# Altium schematic sheet GS_01_Pow.SchDoc: Title
size A1; Date: Date; CompanyName: Integrated Micro-Electronics Bulgaria; Organization: Design & Development Department; Address1: Drawing Type; Address2: Address 1; Address3: Address 2; Address4: Address 3; DocumentNumber: 730xxx; Revision: 01; SheetNumber: 1; SheetTotal: 1; PageSetup: Record=PageOptions|CenterHorizontal=True|CenterVertical=True|PrintScale=0.70|XCorrection=1.00|YCorrection=1.00|PrintKind=2|BorderSize=5000000|LeftOffset=0|BottomOffset=0|Orientation=2|PaperLength=1000|PaperWidth=1000|Scale=100|PaperSource=7|PrintQuality=-4|MediaType=1|DitherType=10|PaperKind=A4|PrintScaleMode=1; SheetSize: A3; Time: Time; ModifiedDate: Mod. Date
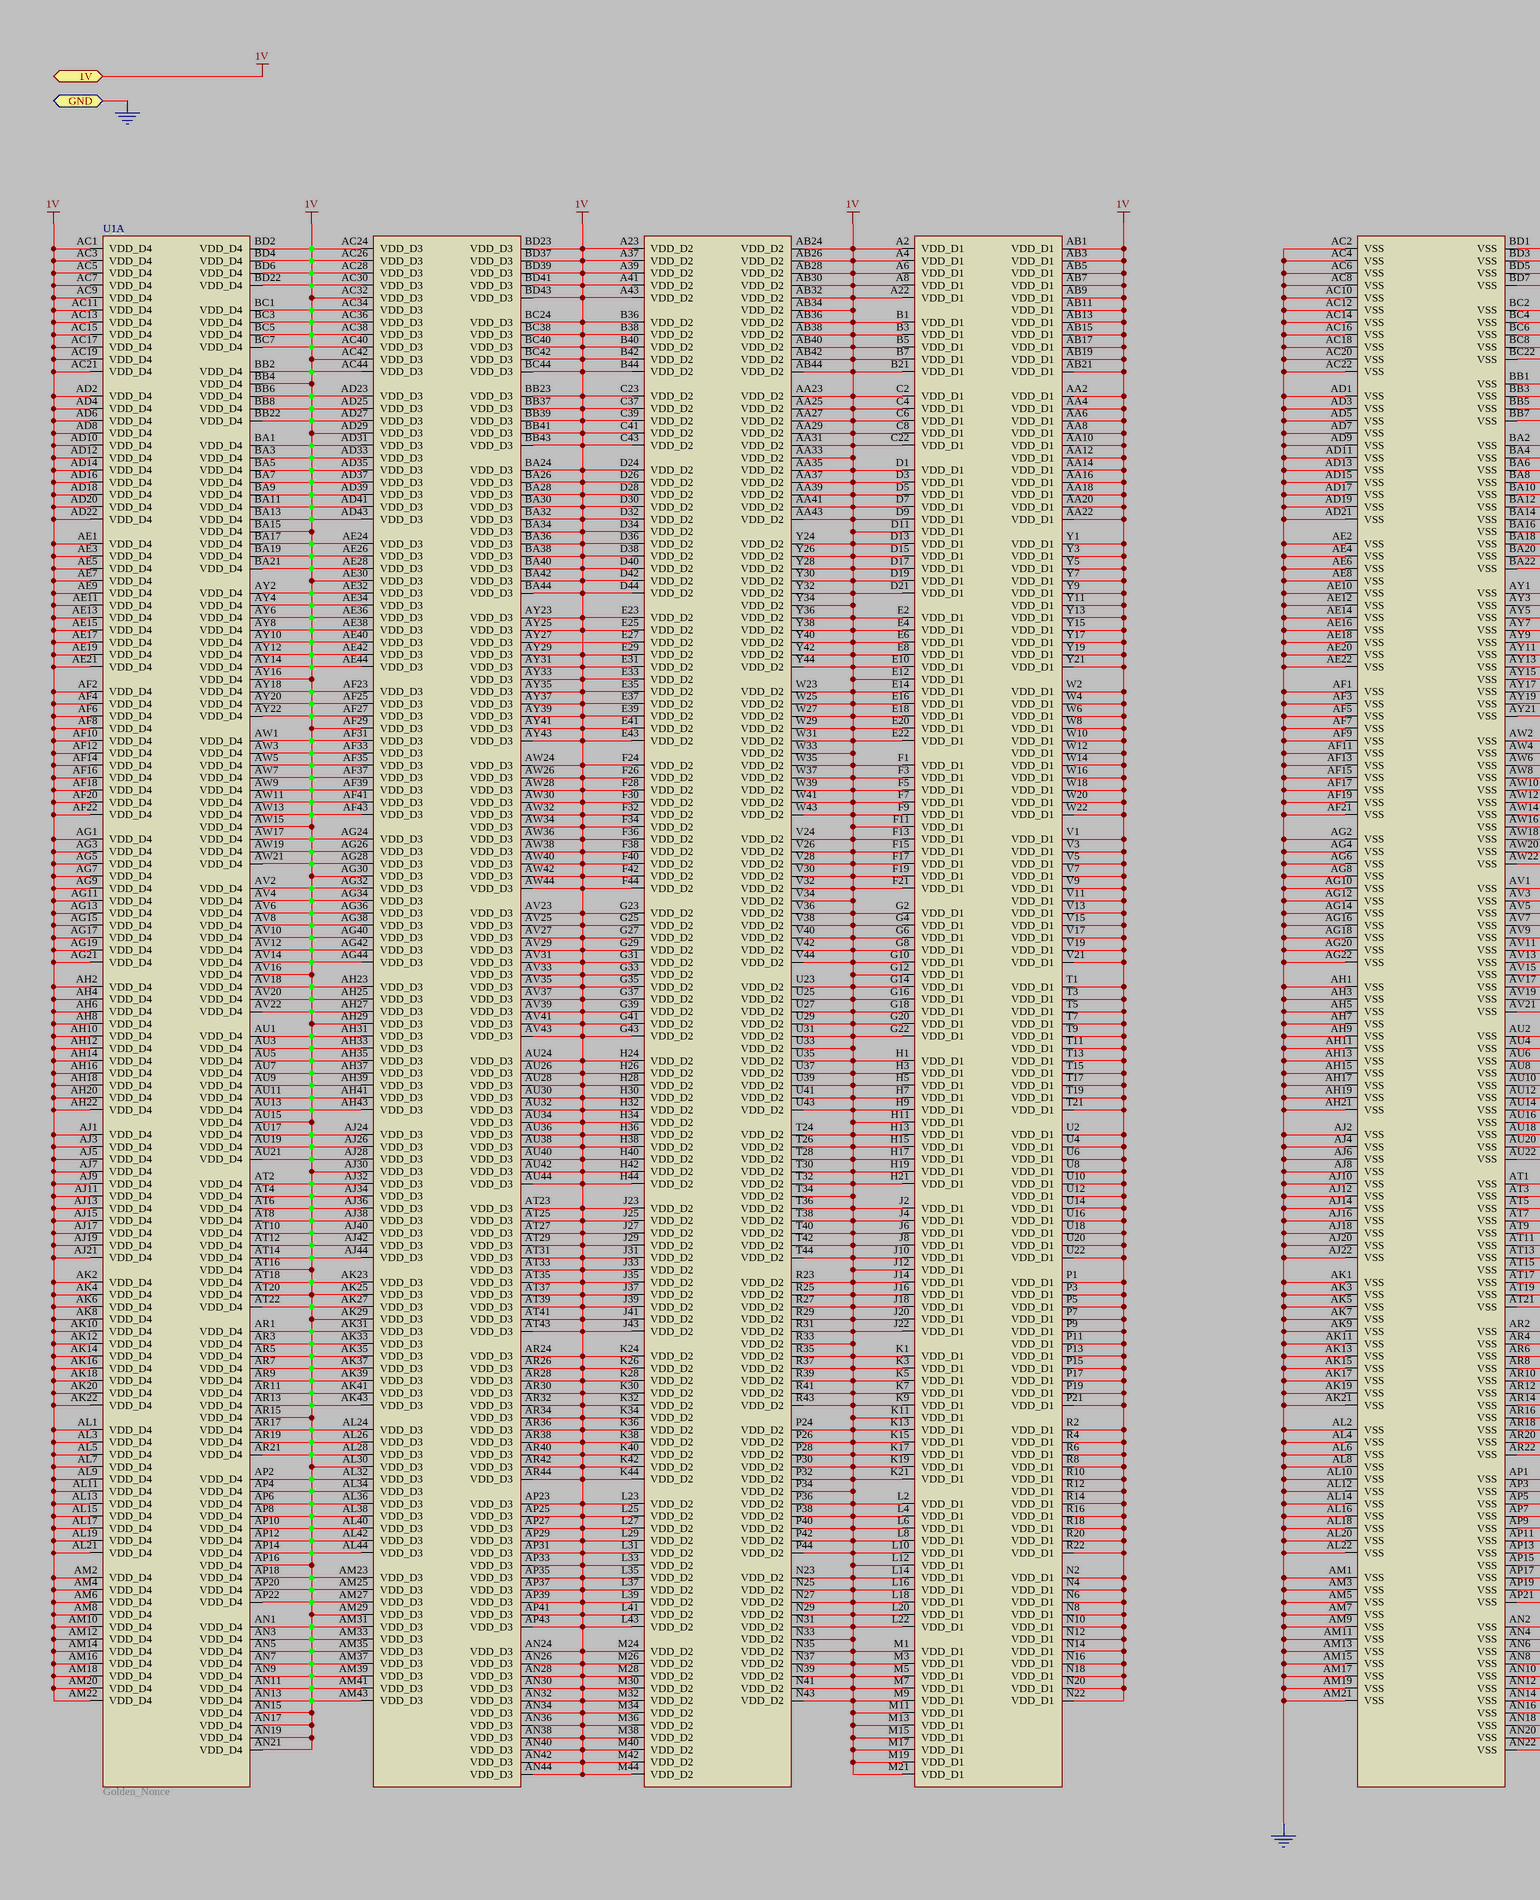
[diagram p0: GS_01_Pow.SchDoc, left]
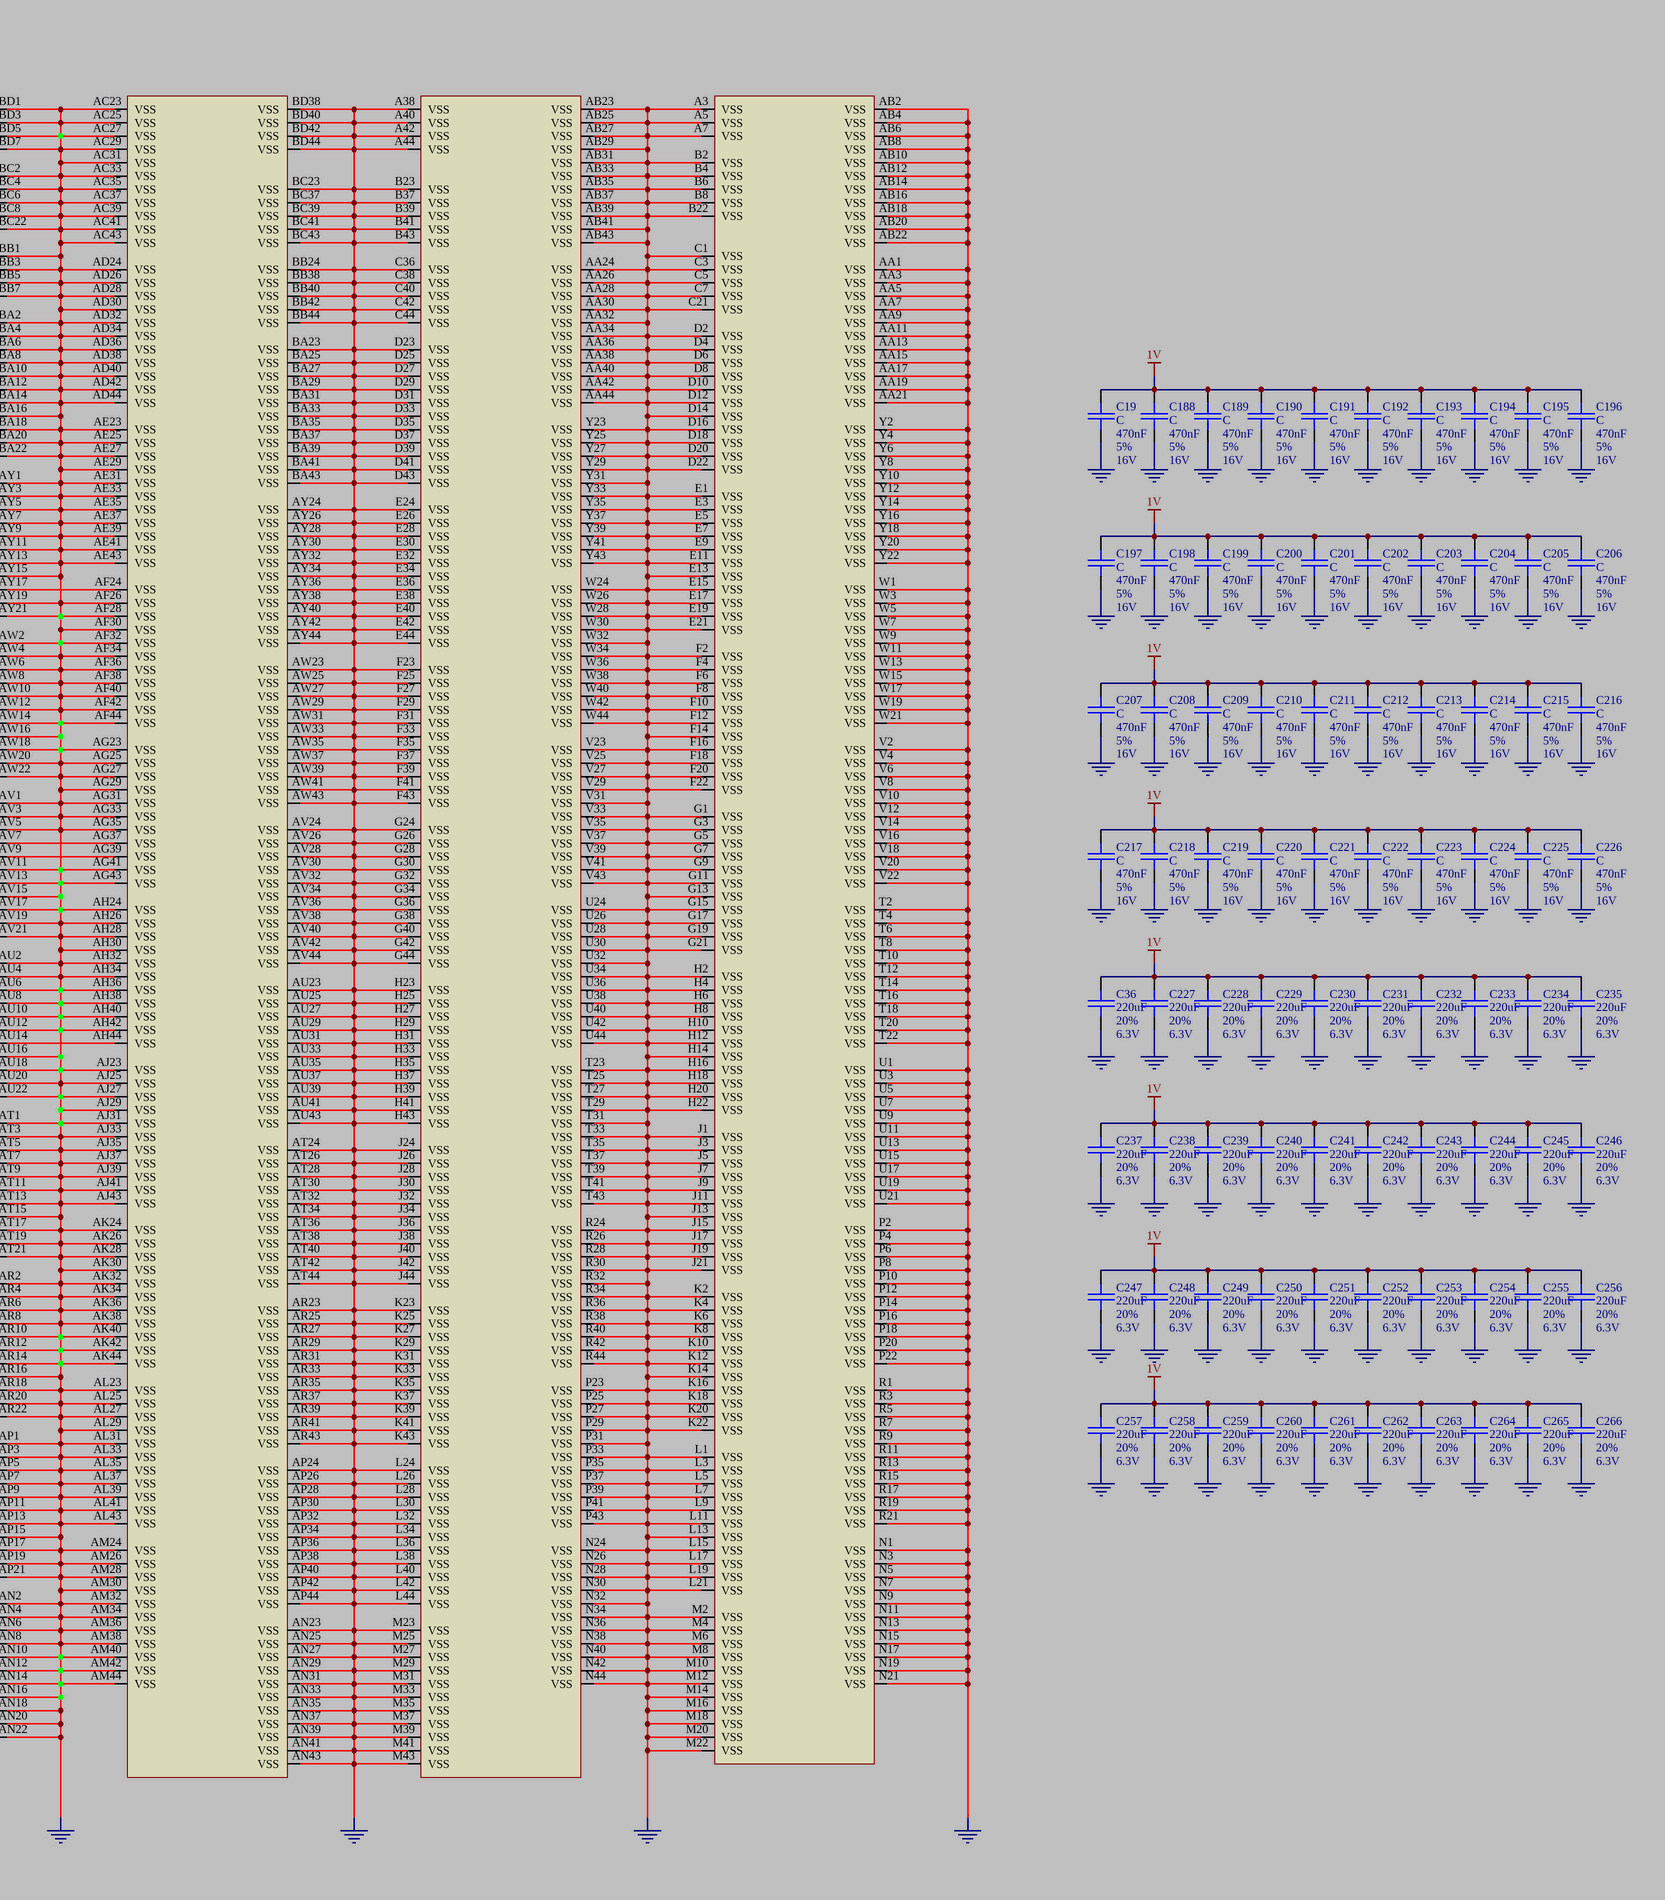
[diagram p1: GS_01_Pow.SchDoc, right]

## Parts
C19  C  DB_VALUE: 470nF  DB_TOLERANCE: 5%  DB_VOLTAGE: 16V  [SMD_0603_CAPC1608X95N]
C36  DB_VALUE: 220uF  DB_TOLERANCE: 20%  DB_VOLTAGE: 6.3V  [SMD_1210_CAPC3225X279N]  (hidden comment: C)
C188  C  DB_VALUE: 470nF  DB_TOLERANCE: 5%  DB_VOLTAGE: 16V  [SMD_0603_CAPC1608X95N]
C189  C  DB_VALUE: 470nF  DB_TOLERANCE: 5%  DB_VOLTAGE: 16V  [SMD_0603_CAPC1608X95N]
C190  C  DB_VALUE: 470nF  DB_TOLERANCE: 5%  DB_VOLTAGE: 16V  [SMD_0603_CAPC1608X95N]
C191  C  DB_VALUE: 470nF  DB_TOLERANCE: 5%  DB_VOLTAGE: 16V  [SMD_0603_CAPC1608X95N]
C192  C  DB_VALUE: 470nF  DB_TOLERANCE: 5%  DB_VOLTAGE: 16V  [SMD_0603_CAPC1608X95N]
C193  C  DB_VALUE: 470nF  DB_TOLERANCE: 5%  DB_VOLTAGE: 16V  [SMD_0603_CAPC1608X95N]
C194  C  DB_VALUE: 470nF  DB_TOLERANCE: 5%  DB_VOLTAGE: 16V  [SMD_0603_CAPC1608X95N]
C195  C  DB_VALUE: 470nF  DB_TOLERANCE: 5%  DB_VOLTAGE: 16V  [SMD_0603_CAPC1608X95N]
C196  C  DB_VALUE: 470nF  DB_TOLERANCE: 5%  DB_VOLTAGE: 16V  [SMD_0603_CAPC1608X95N]
C197  C  DB_VALUE: 470nF  DB_TOLERANCE: 5%  DB_VOLTAGE: 16V  [SMD_0603_CAPC1608X95N]
C198  C  DB_VALUE: 470nF  DB_TOLERANCE: 5%  DB_VOLTAGE: 16V  [SMD_0603_CAPC1608X95N]
C199  C  DB_VALUE: 470nF  DB_TOLERANCE: 5%  DB_VOLTAGE: 16V  [SMD_0603_CAPC1608X95N]
C200  C  DB_VALUE: 470nF  DB_TOLERANCE: 5%  DB_VOLTAGE: 16V  [SMD_0603_CAPC1608X95N]
C201  C  DB_VALUE: 470nF  DB_TOLERANCE: 5%  DB_VOLTAGE: 16V  [SMD_0603_CAPC1608X95N]
C202  C  DB_VALUE: 470nF  DB_TOLERANCE: 5%  DB_VOLTAGE: 16V  [SMD_0603_CAPC1608X95N]
C203  C  DB_VALUE: 470nF  DB_TOLERANCE: 5%  DB_VOLTAGE: 16V  [SMD_0603_CAPC1608X95N]
C204  C  DB_VALUE: 470nF  DB_TOLERANCE: 5%  DB_VOLTAGE: 16V  [SMD_0603_CAPC1608X95N]
C205  C  DB_VALUE: 470nF  DB_TOLERANCE: 5%  DB_VOLTAGE: 16V  [SMD_0603_CAPC1608X95N]
C206  C  DB_VALUE: 470nF  DB_TOLERANCE: 5%  DB_VOLTAGE: 16V  [SMD_0603_CAPC1608X95N]
C207  C  DB_VALUE: 470nF  DB_TOLERANCE: 5%  DB_VOLTAGE: 16V  [SMD_0603_CAPC1608X95N]
C208  C  DB_VALUE: 470nF  DB_TOLERANCE: 5%  DB_VOLTAGE: 16V  [SMD_0603_CAPC1608X95N]
C209  C  DB_VALUE: 470nF  DB_TOLERANCE: 5%  DB_VOLTAGE: 16V  [SMD_0603_CAPC1608X95N]
C210  C  DB_VALUE: 470nF  DB_TOLERANCE: 5%  DB_VOLTAGE: 16V  [SMD_0603_CAPC1608X95N]
C211  C  DB_VALUE: 470nF  DB_TOLERANCE: 5%  DB_VOLTAGE: 16V  [SMD_0603_CAPC1608X95N]
C212  C  DB_VALUE: 470nF  DB_TOLERANCE: 5%  DB_VOLTAGE: 16V  [SMD_0603_CAPC1608X95N]
C213  C  DB_VALUE: 470nF  DB_TOLERANCE: 5%  DB_VOLTAGE: 16V  [SMD_0603_CAPC1608X95N]
C214  C  DB_VALUE: 470nF  DB_TOLERANCE: 5%  DB_VOLTAGE: 16V  [SMD_0603_CAPC1608X95N]
C215  C  DB_VALUE: 470nF  DB_TOLERANCE: 5%  DB_VOLTAGE: 16V  [SMD_0603_CAPC1608X95N]
C216  C  DB_VALUE: 470nF  DB_TOLERANCE: 5%  DB_VOLTAGE: 16V  [SMD_0603_CAPC1608X95N]
C217  C  DB_VALUE: 470nF  DB_TOLERANCE: 5%  DB_VOLTAGE: 16V  [SMD_0603_CAPC1608X95N]
C218  C  DB_VALUE: 470nF  DB_TOLERANCE: 5%  DB_VOLTAGE: 16V  [SMD_0603_CAPC1608X95N]
C219  C  DB_VALUE: 470nF  DB_TOLERANCE: 5%  DB_VOLTAGE: 16V  [SMD_0603_CAPC1608X95N]
C220  C  DB_VALUE: 470nF  DB_TOLERANCE: 5%  DB_VOLTAGE: 16V  [SMD_0603_CAPC1608X95N]
C221  C  DB_VALUE: 470nF  DB_TOLERANCE: 5%  DB_VOLTAGE: 16V  [SMD_0603_CAPC1608X95N]
C222  C  DB_VALUE: 470nF  DB_TOLERANCE: 5%  DB_VOLTAGE: 16V  [SMD_0603_CAPC1608X95N]
C223  C  DB_VALUE: 470nF  DB_TOLERANCE: 5%  DB_VOLTAGE: 16V  [SMD_0603_CAPC1608X95N]
C224  C  DB_VALUE: 470nF  DB_TOLERANCE: 5%  DB_VOLTAGE: 16V  [SMD_0603_CAPC1608X95N]
C225  C  DB_VALUE: 470nF  DB_TOLERANCE: 5%  DB_VOLTAGE: 16V  [SMD_0603_CAPC1608X95N]
C226  C  DB_VALUE: 470nF  DB_TOLERANCE: 5%  DB_VOLTAGE: 16V  [SMD_0603_CAPC1608X95N]
C227  DB_VALUE: 220uF  DB_TOLERANCE: 20%  DB_VOLTAGE: 6.3V  [SMD_1210_CAPC3225X279N]  (hidden comment: C)
C228  DB_VALUE: 220uF  DB_TOLERANCE: 20%  DB_VOLTAGE: 6.3V  [SMD_1210_CAPC3225X279N]  (hidden comment: C)
C229  DB_VALUE: 220uF  DB_TOLERANCE: 20%  DB_VOLTAGE: 6.3V  [SMD_1210_CAPC3225X279N]  (hidden comment: C)
C230  DB_VALUE: 220uF  DB_TOLERANCE: 20%  DB_VOLTAGE: 6.3V  [SMD_1210_CAPC3225X279N]  (hidden comment: C)
C231  DB_VALUE: 220uF  DB_TOLERANCE: 20%  DB_VOLTAGE: 6.3V  [SMD_1210_CAPC3225X279N]  (hidden comment: C)
C232  DB_VALUE: 220uF  DB_TOLERANCE: 20%  DB_VOLTAGE: 6.3V  [SMD_1210_CAPC3225X279N]  (hidden comment: C)
C233  DB_VALUE: 220uF  DB_TOLERANCE: 20%  DB_VOLTAGE: 6.3V  [SMD_1210_CAPC3225X279N]  (hidden comment: C)
C234  DB_VALUE: 220uF  DB_TOLERANCE: 20%  DB_VOLTAGE: 6.3V  [SMD_1210_CAPC3225X279N]  (hidden comment: C)
C235  DB_VALUE: 220uF  DB_TOLERANCE: 20%  DB_VOLTAGE: 6.3V  [SMD_1210_CAPC3225X279N]  (hidden comment: C)
C237  DB_VALUE: 220uF  DB_TOLERANCE: 20%  DB_VOLTAGE: 6.3V  [SMD_1210_CAPC3225X279N]  (hidden comment: C)
C238  DB_VALUE: 220uF  DB_TOLERANCE: 20%  DB_VOLTAGE: 6.3V  [SMD_1210_CAPC3225X279N]  (hidden comment: C)
C239  DB_VALUE: 220uF  DB_TOLERANCE: 20%  DB_VOLTAGE: 6.3V  [SMD_1210_CAPC3225X279N]  (hidden comment: C)
C240  DB_VALUE: 220uF  DB_TOLERANCE: 20%  DB_VOLTAGE: 6.3V  [SMD_1210_CAPC3225X279N]  (hidden comment: C)
C241  DB_VALUE: 220uF  DB_TOLERANCE: 20%  DB_VOLTAGE: 6.3V  [SMD_1210_CAPC3225X279N]  (hidden comment: C)
C242  DB_VALUE: 220uF  DB_TOLERANCE: 20%  DB_VOLTAGE: 6.3V  [SMD_1210_CAPC3225X279N]  (hidden comment: C)
C243  DB_VALUE: 220uF  DB_TOLERANCE: 20%  DB_VOLTAGE: 6.3V  [SMD_1210_CAPC3225X279N]  (hidden comment: C)
C244  DB_VALUE: 220uF  DB_TOLERANCE: 20%  DB_VOLTAGE: 6.3V  [SMD_1210_CAPC3225X279N]  (hidden comment: C)
C245  DB_VALUE: 220uF  DB_TOLERANCE: 20%  DB_VOLTAGE: 6.3V  [SMD_1210_CAPC3225X279N]  (hidden comment: C)
C246  DB_VALUE: 220uF  DB_TOLERANCE: 20%  DB_VOLTAGE: 6.3V  [SMD_1210_CAPC3225X279N]  (hidden comment: C)
C247  DB_VALUE: 220uF  DB_TOLERANCE: 20%  DB_VOLTAGE: 6.3V  [SMD_1210_CAPC3225X279N]  (hidden comment: C)
C248  DB_VALUE: 220uF  DB_TOLERANCE: 20%  DB_VOLTAGE: 6.3V  [SMD_1210_CAPC3225X279N]  (hidden comment: C)
C249  DB_VALUE: 220uF  DB_TOLERANCE: 20%  DB_VOLTAGE: 6.3V  [SMD_1210_CAPC3225X279N]  (hidden comment: C)
C250  DB_VALUE: 220uF  DB_TOLERANCE: 20%  DB_VOLTAGE: 6.3V  [SMD_1210_CAPC3225X279N]  (hidden comment: C)
C251  DB_VALUE: 220uF  DB_TOLERANCE: 20%  DB_VOLTAGE: 6.3V  [SMD_1210_CAPC3225X279N]  (hidden comment: C)
C252  DB_VALUE: 220uF  DB_TOLERANCE: 20%  DB_VOLTAGE: 6.3V  [SMD_1210_CAPC3225X279N]  (hidden comment: C)
C253  DB_VALUE: 220uF  DB_TOLERANCE: 20%  DB_VOLTAGE: 6.3V  [SMD_1210_CAPC3225X279N]  (hidden comment: C)
C254  DB_VALUE: 220uF  DB_TOLERANCE: 20%  DB_VOLTAGE: 6.3V  [SMD_1210_CAPC3225X279N]  (hidden comment: C)
C255  DB_VALUE: 220uF  DB_TOLERANCE: 20%  DB_VOLTAGE: 6.3V  [SMD_1210_CAPC3225X279N]  (hidden comment: C)
C256  DB_VALUE: 220uF  DB_TOLERANCE: 20%  DB_VOLTAGE: 6.3V  [SMD_1210_CAPC3225X279N]  (hidden comment: C)
C257  DB_VALUE: 220uF  DB_TOLERANCE: 20%  DB_VOLTAGE: 6.3V  [SMD_1210_CAPC3225X279N]  (hidden comment: C)
C258  DB_VALUE: 220uF  DB_TOLERANCE: 20%  DB_VOLTAGE: 6.3V  [SMD_1210_CAPC3225X279N]  (hidden comment: C)
C259  DB_VALUE: 220uF  DB_TOLERANCE: 20%  DB_VOLTAGE: 6.3V  [SMD_1210_CAPC3225X279N]  (hidden comment: C)
C260  DB_VALUE: 220uF  DB_TOLERANCE: 20%  DB_VOLTAGE: 6.3V  [SMD_1210_CAPC3225X279N]  (hidden comment: C)
C261  DB_VALUE: 220uF  DB_TOLERANCE: 20%  DB_VOLTAGE: 6.3V  [SMD_1210_CAPC3225X279N]  (hidden comment: C)
C262  DB_VALUE: 220uF  DB_TOLERANCE: 20%  DB_VOLTAGE: 6.3V  [SMD_1210_CAPC3225X279N]  (hidden comment: C)
C263  DB_VALUE: 220uF  DB_TOLERANCE: 20%  DB_VOLTAGE: 6.3V  [SMD_1210_CAPC3225X279N]  (hidden comment: C)
C264  DB_VALUE: 220uF  DB_TOLERANCE: 20%  DB_VOLTAGE: 6.3V  [SMD_1210_CAPC3225X279N]  (hidden comment: C)
C265  DB_VALUE: 220uF  DB_TOLERANCE: 20%  DB_VOLTAGE: 6.3V  [SMD_1210_CAPC3225X279N]  (hidden comment: C)
C266  DB_VALUE: 220uF  DB_TOLERANCE: 20%  DB_VOLTAGE: 6.3V  [SMD_1210_CAPC3225X279N]  (hidden comment: C)
U1  Golden_Nonce  (part A of 5)

## Ports
1V, GND

## Nets
1V: C19.2 C36.2 C188.2 C189.2 C190.2 C191.2 C192.2 C193.2 C194.2 C195.2 C196.2 C197.2 C198.2 C199.2 C200.2 C201.2 C202.2 C203.2 C204.2 C205.2 C206.2 C207.2 C208.2 C209.2 C210.2 C211.2 C212.2 C213.2 C214.2 C215.2 C216.2 C217.2 C218.2 C219.2 C220.2 C221.2 C222.2 C223.2 C224.2 C225.2 C226.2 C227.2 C228.2 C229.2 C230.2 C231.2 C232.2 C233.2 C234.2 C235.2 C237.2 C238.2 C239.2 C240.2 C241.2 C242.2 C243.2 C244.2 C245.2 C246.2 C247.2 C248.2 C249.2 C250.2 C251.2 C252.2 C253.2 C254.2 C255.2 C256.2 C257.2 C258.2 C259.2 C260.2 C261.2 C262.2 C263.2 C264.2 C265.2 C266.2 U1.A2(VDD_D1) U1.A4(VDD_D1) U1.A6(VDD_D1) U1.A8(VDD_D1) U1.A22(VDD_D1) U1.A23(VDD_D2) U1.A37(VDD_D2) U1.A39(VDD_D2) U1.A41(VDD_D2) U1.A43(VDD_D2) U1.AA2(VDD_D1) U1.AA4(VDD_D1) U1.AA6(VDD_D1) U1.AA8(VDD_D1) U1.AA10(VDD_D1) U1.AA12(VDD_D1) U1.AA14(VDD_D1) U1.AA16(VDD_D1) U1.AA18(VDD_D1) U1.AA20(VDD_D1) U1.AA22(VDD_D1) U1.AA23(VDD_D2) U1.AA25(VDD_D2) U1.AA27(VDD_D2) U1.AA29(VDD_D2) U1.AA31(VDD_D2) U1.AA33(VDD_D2) U1.AA35(VDD_D2) U1.AA37(VDD_D2) U1.AA39(VDD_D2) U1.AA41(VDD_D2) U1.AA43(VDD_D2) U1.AB1(VDD_D1) U1.AB3(VDD_D1) U1.AB5(VDD_D1) U1.AB7(VDD_D1) U1.AB9(VDD_D1) U1.AB11(VDD_D1) U1.AB13(VDD_D1) U1.AB15(VDD_D1) U1.AB17(VDD_D1) U1.AB19(VDD_D1) U1.AB21(VDD_D1) U1.AB24(VDD_D2) U1.AB26(VDD_D2) U1.AB28(VDD_D2) U1.AB30(VDD_D2) U1.AB32(VDD_D2) U1.AB34(VDD_D2) U1.AB36(VDD_D2) U1.AB38(VDD_D2) U1.AB40(VDD_D2) U1.AB42(VDD_D2) U1.AB44(VDD_D2) U1.AC1(VDD_D4) U1.AC3(VDD_D4) U1.AC5(VDD_D4) U1.AC7(VDD_D4) U1.AC9(VDD_D4) U1.AC11(VDD_D4) U1.AC13(VDD_D4) U1.AC15(VDD_D4) U1.AC17(VDD_D4) U1.AC19(VDD_D4) U1.AC21(VDD_D4) U1.AC24(VDD_D3) U1.AC26(VDD_D3) U1.AC28(VDD_D3) U1.AC30(VDD_D3) U1.AC32(VDD_D3) U1.AC34(VDD_D3) U1.AC36(VDD_D3) U1.AC38(VDD_D3) U1.AC40(VDD_D3) U1.AC42(VDD_D3) U1.AC44(VDD_D3) U1.AD2(VDD_D4) U1.AD4(VDD_D4) U1.AD6(VDD_D4) U1.AD8(VDD_D4) U1.AD10(VDD_D4) U1.AD12(VDD_D4) U1.AD14(VDD_D4) U1.AD16(VDD_D4) U1.AD18(VDD_D4) U1.AD20(VDD_D4) U1.AD22(VDD_D4) U1.AD23(VDD_D3) U1.AD25(VDD_D3) U1.AD27(VDD_D3) U1.AD29(VDD_D3) U1.AD31(VDD_D3) U1.AD33(VDD_D3) U1.AD35(VDD_D3) U1.AD37(VDD_D3) U1.AD39(VDD_D3) U1.AD41(VDD_D3) U1.AD43(VDD_D3) U1.AE1(VDD_D4) U1.AE3(VDD_D4) U1.AE5(VDD_D4) U1.AE7(VDD_D4) U1.AE9(VDD_D4) U1.AE11(VDD_D4) U1.AE13(VDD_D4) U1.AE15(VDD_D4) U1.AE17(VDD_D4) U1.AE19(VDD_D4) U1.AE21(VDD_D4) U1.AE24(VDD_D3) U1.AE26(VDD_D3) U1.AE28(VDD_D3) U1.AE30(VDD_D3) U1.AE32(VDD_D3) U1.AE34(VDD_D3) U1.AE36(VDD_D3) U1.AE38(VDD_D3) U1.AE40(VDD_D3) U1.AE42(VDD_D3) U1.AE44(VDD_D3) U1.AF2(VDD_D4) U1.AF4(VDD_D4) U1.AF6(VDD_D4) U1.AF8(VDD_D4) U1.AF10(VDD_D4) U1.AF12(VDD_D4) U1.AF14(VDD_D4) U1.AF16(VDD_D4) U1.AF18(VDD_D4) U1.AF20(VDD_D4) U1.AF22(VDD_D4) U1.AF23(VDD_D3) U1.AF25(VDD_D3) U1.AF27(VDD_D3) U1.AF29(VDD_D3) U1.AF31(VDD_D3) U1.AF33(VDD_D3) U1.AF35(VDD_D3) U1.AF37(VDD_D3) U1.AF39(VDD_D3) U1.AF41(VDD_D3) U1.AF43(VDD_D3) U1.AG1(VDD_D4) U1.AG3(VDD_D4) U1.AG5(VDD_D4) U1.AG7(VDD_D4) U1.AG9(VDD_D4) U1.AG11(VDD_D4) U1.AG13(VDD_D4) U1.AG15(VDD_D4) U1.AG17(VDD_D4) U1.AG19(VDD_D4) U1.AG21(VDD_D4) U1.AG24(VDD_D3) U1.AG26(VDD_D3) U1.AG28(VDD_D3) U1.AG30(VDD_D3) U1.AG32(VDD_D3) U1.AG34(VDD_D3) U1.AG36(VDD_D3) U1.AG38(VDD_D3) U1.AG40(VDD_D3) U1.AG42(VDD_D3) U1.AG44(VDD_D3) U1.AH2(VDD_D4) U1.AH4(VDD_D4) U1.AH6(VDD_D4) U1.AH8(VDD_D4) U1.AH10(VDD_D4) U1.AH12(VDD_D4) U1.AH14(VDD_D4) U1.AH16(VDD_D4) U1.AH18(VDD_D4) U1.AH20(VDD_D4) U1.AH22(VDD_D4) U1.AH23(VDD_D3) U1.AH25(VDD_D3) U1.AH27(VDD_D3) U1.AH29(VDD_D3) U1.AH31(VDD_D3) U1.AH33(VDD_D3) U1.AH35(VDD_D3) U1.AH37(VDD_D3) U1.AH39(VDD_D3) U1.AH41(VDD_D3) U1.AH43(VDD_D3) U1.AJ1(VDD_D4) U1.AJ3(VDD_D4) U1.AJ5(VDD_D4) U1.AJ7(VDD_D4) U1.AJ9(VDD_D4) U1.AJ11(VDD_D4) U1.AJ13(VDD_D4) U1.AJ15(VDD_D4) U1.AJ17(VDD_D4) U1.AJ19(VDD_D4) U1.AJ21(VDD_D4) U1.AJ24(VDD_D3) U1.AJ26(VDD_D3) U1.AJ28(VDD_D3) U1.AJ30(VDD_D3) U1.AJ32(VDD_D3) U1.AJ34(VDD_D3) U1.AJ36(VDD_D3) U1.AJ38(VDD_D3) U1.AJ40(VDD_D3) U1.AJ42(VDD_D3) U1.AJ44(VDD_D3) U1.AK2(VDD_D4) U1.AK4(VDD_D4) U1.AK6(VDD_D4) U1.AK8(VDD_D4) U1.AK10(VDD_D4) U1.AK12(VDD_D4) U1.AK14(VDD_D4) U1.AK16(VDD_D4) U1.AK18(VDD_D4) U1.AK20(VDD_D4) U1.AK22(VDD_D4) U1.AK23(VDD_D3) U1.AK25(VDD_D3) U1.AK27(VDD_D3) U1.AK29(VDD_D3) U1.AK31(VDD_D3) U1.AK33(VDD_D3) U1.AK35(VDD_D3) U1.AK37(VDD_D3) U1.AK39(VDD_D3) U1.AK41(VDD_D3) U1.AK43(VDD_D3) U1.AL1(VDD_D4) U1.AL3(VDD_D4) U1.AL5(VDD_D4) U1.AL7(VDD_D4) U1.AL9(VDD_D4) U1.AL11(VDD_D4) U1.AL13(VDD_D4) U1.AL15(VDD_D4) U1.AL17(VDD_D4) U1.AL19(VDD_D4) U1.AL21(VDD_D4) U1.AL24(VDD_D3) U1.AL26(VDD_D3) U1.AL28(VDD_D3) U1.AL30(VDD_D3) U1.AL32(VDD_D3) U1.AL34(VDD_D3) U1.AL36(VDD_D3) U1.AL38(VDD_D3) U1.AL40(VDD_D3) U1.AL42(VDD_D3) U1.AL44(VDD_D3) U1.AM2(VDD_D4) U1.AM4(VDD_D4) U1.AM6(VDD_D4) U1.AM8(VDD_D4) U1.AM10(VDD_D4) U1.AM12(VDD_D4) U1.AM14(VDD_D4) U1.AM16(VDD_D4) U1.AM18(VDD_D4) U1.AM20(VDD_D4) U1.AM22(VDD_D4) U1.AM23(VDD_D3) U1.AM25(VDD_D3) U1.AM27(VDD_D3) U1.AM29(VDD_D3) U1.AM31(VDD_D3) U1.AM33(VDD_D3) U1.AM35(VDD_D3) U1.AM37(VDD_D3) U1.AM39(VDD_D3) U1.AM41(VDD_D3) U1.AM43(VDD_D3) U1.AN1(VDD_D4) U1.AN3(VDD_D4) U1.AN5(VDD_D4) U1.AN7(VDD_D4) U1.AN9(VDD_D4) U1.AN11(VDD_D4) U1.AN13(VDD_D4) U1.AN15(VDD_D4) U1.AN17(VDD_D4) U1.AN19(VDD_D4) U1.AN21(VDD_D4) U1.AN24(VDD_D3) U1.AN26(VDD_D3) U1.AN28(VDD_D3) U1.AN30(VDD_D3) U1.AN32(VDD_D3) U1.AN34(VDD_D3) U1.AN36(VDD_D3) U1.AN38(VDD_D3) U1.AN40(VDD_D3) U1.AN42(VDD_D3) U1.AN44(VDD_D3) U1.AP2(VDD_D4) U1.AP4(VDD_D4) U1.AP6(VDD_D4) U1.AP8(VDD_D4) U1.AP10(VDD_D4) U1.AP12(VDD_D4) U1.AP14(VDD_D4) U1.AP16(VDD_D4) U1.AP18(VDD_D4) U1.AP20(VDD_D4) U1.AP22(VDD_D4) U1.AP23(VDD_D3) U1.AP25(VDD_D3) U1.AP27(VDD_D3) U1.AP29(VDD_D3) U1.AP31(VDD_D3) U1.AP33(VDD_D3) U1.AP35(VDD_D3) U1.AP37(VDD_D3) U1.AP39(VDD_D3) U1.AP41(VDD_D3) U1.AP43(VDD_D3) U1.AR1(VDD_D4) U1.AR3(VDD_D4) U1.AR5(VDD_D4) U1.AR7(VDD_D4) U1.AR9(VDD_D4) U1.AR11(VDD_D4) U1.AR13(VDD_D4) U1.AR15(VDD_D4) U1.AR17(VDD_D4) U1.AR19(VDD_D4) U1.AR21(VDD_D4) U1.AR24(VDD_D3) U1.AR26(VDD_D3) U1.AR28(VDD_D3) U1.AR30(VDD_D3) U1.AR32(VDD_D3) U1.AR34(VDD_D3) U1.AR36(VDD_D3) U1.AR38(VDD_D3) U1.AR40(VDD_D3) U1.AR42(VDD_D3) U1.AR44(VDD_D3) U1.AT2(VDD_D4) U1.AT4(VDD_D4) U1.AT6(VDD_D4) U1.AT8(VDD_D4) U1.AT10(VDD_D4) U1.AT12(VDD_D4) U1.AT14(VDD_D4) U1.AT16(VDD_D4) U1.AT18(VDD_D4) U1.AT20(VDD_D4) U1.AT22(VDD_D4) U1.AT23(VDD_D3) U1.AT25(VDD_D3) U1.AT27(VDD_D3) U1.AT29(VDD_D3) U1.AT31(VDD_D3) U1.AT33(VDD_D3) U1.AT35(VDD_D3) U1.AT37(VDD_D3) U1.AT39(VDD_D3) U1.AT41(VDD_D3) U1.AT43(VDD_D3) U1.AU1(VDD_D4) U1.AU3(VDD_D4) U1.AU5(VDD_D4) U1.AU7(VDD_D4) U1.AU9(VDD_D4) U1.AU11(VDD_D4) U1.AU13(VDD_D4) U1.AU15(VDD_D4) U1.AU17(VDD_D4) U1.AU19(VDD_D4) U1.AU21(VDD_D4) U1.AU24(VDD_D3) U1.AU26(VDD_D3) U1.AU28(VDD_D3) U1.AU30(VDD_D3) U1.AU32(VDD_D3) U1.AU34(VDD_D3) U1.AU36(VDD_D3) U1.AU38(VDD_D3) U1.AU40(VDD_D3) U1.AU42(VDD_D3) U1.AU44(VDD_D3) U1.AV2(VDD_D4) U1.AV4(VDD_D4) U1.AV6(VDD_D4) U1.AV8(VDD_D4) U1.AV10(VDD_D4) U1.AV12(VDD_D4) U1.AV14(VDD_D4) U1.AV16(VDD_D4) U1.AV18(VDD_D4) U1.AV20(VDD_D4) U1.AV22(VDD_D4) U1.AV23(VDD_D3) U1.AV25(VDD_D3) U1.AV27(VDD_D3) U1.AV29(VDD_D3) U1.AV31(VDD_D3) U1.AV33(VDD_D3) U1.AV35(VDD_D3) U1.AV37(VDD_D3) U1.AV39(VDD_D3) U1.AV41(VDD_D3) U1.AV43(VDD_D3) U1.AW1(VDD_D4) U1.AW3(VDD_D4) U1.AW5(VDD_D4) U1.AW7(VDD_D4) U1.AW9(VDD_D4) U1.AW11(VDD_D4) U1.AW13(VDD_D4) U1.AW15(VDD_D4) U1.AW17(VDD_D4) U1.AW19(VDD_D4) U1.AW21(VDD_D4) U1.AW24(VDD_D3) U1.AW26(VDD_D3) U1.AW28(VDD_D3) U1.AW30(VDD_D3) U1.AW32(VDD_D3) U1.AW34(VDD_D3) U1.AW36(VDD_D3) U1.AW38(VDD_D3) U1.AW40(VDD_D3) U1.AW42(VDD_D3) U1.AW44(VDD_D3) U1.AY2(VDD_D4) U1.AY4(VDD_D4) U1.AY6(VDD_D4) U1.AY8(VDD_D4) U1.AY10(VDD_D4) U1.AY12(VDD_D4) U1.AY14(VDD_D4) U1.AY16(VDD_D4) U1.AY18(VDD_D4) U1.AY20(VDD_D4) U1.AY22(VDD_D4) U1.AY23(VDD_D3) U1.AY25(VDD_D3) U1.AY29(VDD_D3) U1.AY31(VDD_D3) U1.AY33(VDD_D3) U1.AY35(VDD_D3) U1.AY37(VDD_D3) U1.AY39(VDD_D3) U1.AY41(VDD_D3) U1.AY43(VDD_D3) U1.B1(VDD_D1) U1.B3(VDD_D1) U1.B5(VDD_D1) U1.B7(VDD_D1) U1.B21(VDD_D1) U1.B36(VDD_D2) U1.B38(VDD_D2) U1.B40(VDD_D2) U1.B42(VDD_D2) U1.B44(VDD_D2) U1.BA1(VDD_D4) U1.BA3(VDD_D4) U1.BA5(VDD_D4) U1.BA7(VDD_D4) U1.BA9(VDD_D4) U1.BA11(VDD_D4) U1.BA13(VDD_D4) U1.BA15(VDD_D4) U1.BA17(VDD_D4) U1.BA19(VDD_D4) U1.BA21(VDD_D4) U1.BA24(VDD_D3) U1.BA26(VDD_D3) U1.BA28(VDD_D3) U1.BA30(VDD_D3) U1.BA32(VDD_D3) U1.BA34(VDD_D3) U1.BA36(VDD_D3) U1.BA38(VDD_D3) U1.BA40(VDD_D3) U1.BA42(VDD_D3) U1.BA44(VDD_D3) U1.BB2(VDD_D4) U1.BB4(VDD_D4) U1.BB6(VDD_D4) U1.BB8(VDD_D4) U1.BB22(VDD_D4) U1.BB23(VDD_D3) U1.BB37(VDD_D3) U1.BB39(VDD_D3) U1.BB41(VDD_D3) U1.BB43(VDD_D3) U1.BC1(VDD_D4) U1.BC3(VDD_D4) U1.BC5(VDD_D4) U1.BC7(VDD_D4) U1.BC24(VDD_D3) U1.BC38(VDD_D3) U1.BC40(VDD_D3) U1.BC42(VDD_D3) U1.BC44(VDD_D3) U1.BD2(VDD_D4) U1.BD4(VDD_D4) U1.BD6(VDD_D4) U1.BD22(VDD_D4) U1.BD23(VDD_D3) U1.BD37(VDD_D3) U1.BD39(VDD_D3) U1.BD41(VDD_D3) U1.BD43(VDD_D3) U1.C2(VDD_D1) U1.C4(VDD_D1) U1.C6(VDD_D1) U1.C8(VDD_D1) U1.C22(VDD_D1) U1.C23(VDD_D2) U1.C37(VDD_D2) U1.C39(VDD_D2) U1.C41(VDD_D2) U1.C43(VDD_D2) U1.D1(VDD_D1) U1.D3(VDD_D1) U1.D5(VDD_D1) U1.D7(VDD_D1) U1.D9(VDD_D1) U1.D11(VDD_D1) U1.D13(VDD_D1) U1.D15(VDD_D1) U1.D17(VDD_D1) U1.D19(VDD_D1) U1.D21(VDD_D1) U1.D24(VDD_D2) U1.D26(VDD_D2) U1.D28(VDD_D2) U1.D30(VDD_D2) U1.D32(VDD_D2) U1.D34(VDD_D2) U1.D36(VDD_D2) U1.D38(VDD_D2) U1.D40(VDD_D2) U1.D42(VDD_D2) U1.D44(VDD_D2) U1.E2(VDD_D1) U1.E4(VDD_D1) U1.E6(VDD_D1) U1.E8(VDD_D1) U1.E10(VDD_D1) U1.E12(VDD_D1) U1.E14(VDD_D1) U1.E16(VDD_D1) U1.E18(VDD_D1) U1.E20(VDD_D1) U1.E22(VDD_D1) U1.E23(VDD_D2) U1.E25(VDD_D2) U1.E29(VDD_D2) U1.E31(VDD_D2) U1.E33(VDD_D2) U1.E35(VDD_D2) U1.E37(VDD_D2) U1.E39(VDD_D2) U1.E41(VDD_D2) U1.E43(VDD_D2) U1.F1(VDD_D1) U1.F3(VDD_D1) U1.F5(VDD_D1) U1.F7(VDD_D1) U1.F9(VDD_D1) U1.F11(VDD_D1) U1.F13(VDD_D1) U1.F15(VDD_D1) U1.F17(VDD_D1) U1.F19(VDD_D1) U1.F21(VDD_D1) U1.F24(VDD_D2) U1.F26(VDD_D2) U1.F28(VDD_D2) U1.F30(VDD_D2) U1.F32(VDD_D2) U1.F34(VDD_D2) U1.F36(VDD_D2) U1.F38(VDD_D2) U1.F40(VDD_D2) U1.F42(VDD_D2) U1.F44(VDD_D2) U1.G2(VDD_D1) U1.G4(VDD_D1) U1.G6(VDD_D1) U1.G8(VDD_D1) U1.G10(VDD_D1) U1.G12(VDD_D1) U1.G14(VDD_D1) U1.G16(VDD_D1) U1.G18(VDD_D1) U1.G20(VDD_D1) U1.G22(VDD_D1) U1.G23(VDD_D2) U1.G25(VDD_D2) U1.G27(VDD_D2) U1.G29(VDD_D2) U1.G31(VDD_D2) U1.G33(VDD_D2) U1.G35(VDD_D2) U1.G37(VDD_D2) U1.G39(VDD_D2) U1.G41(VDD_D2) U1.G43(VDD_D2) U1.H1(VDD_D1) U1.H3(VDD_D1) U1.H5(VDD_D1) U1.H7(VDD_D1) U1.H9(VDD_D1) U1.H11(VDD_D1) U1.H13(VDD_D1) U1.H15(VDD_D1) U1.H17(VDD_D1) U1.H19(VDD_D1) U1.H21(VDD_D1) U1.H24(VDD_D2) U1.H26(VDD_D2) U1.H28(VDD_D2) U1.H30(VDD_D2) U1.H32(VDD_D2) U1.H34(VDD_D2) U1.H36(VDD_D2) U1.H38(VDD_D2) U1.H40(VDD_D2) U1.H42(VDD_D2) U1.H44(VDD_D2) U1.J2(VDD_D1) U1.J4(VDD_D1) U1.J6(VDD_D1) U1.J8(VDD_D1) U1.J10(VDD_D1) U1.J12(VDD_D1) U1.J14(VDD_D1) U1.J16(VDD_D1) U1.J18(VDD_D1) U1.J20(VDD_D1) U1.J22(VDD_D1) U1.J23(VDD_D2) U1.J25(VDD_D2) U1.J27(VDD_D2) U1.J29(VDD_D2) U1.J31(VDD_D2) U1.J33(VDD_D2) U1.J35(VDD_D2) U1.J37(VDD_D2) U1.J39(VDD_D2) U1.J41(VDD_D2) U1.J43(VDD_D2) U1.K1(VDD_D1) U1.K3(VDD_D1) U1.K5(VDD_D1) U1.K7(VDD_D1) U1.K9(VDD_D1) U1.K11(VDD_D1) U1.K13(VDD_D1) U1.K15(VDD_D1) U1.K17(VDD_D1) U1.K19(VDD_D1) U1.K21(VDD_D1) U1.K24(VDD_D2) U1.K26(VDD_D2) U1.K28(VDD_D2) U1.K30(VDD_D2) U1.K32(VDD_D2) U1.K34(VDD_D2) U1.K36(VDD_D2) U1.K38(VDD_D2) U1.K40(VDD_D2) U1.K42(VDD_D2) U1.K44(VDD_D2) U1.L2(VDD_D1) U1.L4(VDD_D1) U1.L6(VDD_D1) U1.L8(VDD_D1) U1.L10(VDD_D1) U1.L12(VDD_D1) U1.L14(VDD_D1) U1.L16(VDD_D1) U1.L18(VDD_D1) U1.L20(VDD_D1) U1.L22(VDD_D1) U1.L23(VDD_D2) U1.L25(VDD_D2) U1.L27(VDD_D2) U1.L29(VDD_D2) U1.L31(VDD_D2) U1.L33(VDD_D2) U1.L35(VDD_D2) U1.L37(VDD_D2) U1.L39(VDD_D2) U1.L41(VDD_D2) U1.L43(VDD_D2) U1.M1(VDD_D1) U1.M3(VDD_D1) U1.M5(VDD_D1) U1.M7(VDD_D1) U1.M9(VDD_D1) U1.M11(VDD_D1) U1.M13(VDD_D1) U1.M15(VDD_D1) U1.M17(VDD_D1) U1.M19(VDD_D1) U1.M21(VDD_D1) U1.M24(VDD_D2) U1.M26(VDD_D2) U1.M28(VDD_D2) U1.M30(VDD_D2) U1.M32(VDD_D2) U1.M34(VDD_D2) U1.M36(VDD_D2) U1.M38(VDD_D2) U1.M40(VDD_D2) U1.M42(VDD_D2) U1.M44(VDD_D2) U1.N2(VDD_D1) U1.N4(VDD_D1) U1.N6(VDD_D1) U1.N8(VDD_D1) U1.N10(VDD_D1) U1.N12(VDD_D1) U1.N14(VDD_D1) U1.N16(VDD_D1) U1.N18(VDD_D1) U1.N20(VDD_D1) U1.N22(VDD_D1) U1.N23(VDD_D2) U1.N25(VDD_D2) U1.N27(VDD_D2) U1.N29(VDD_D2) U1.N31(VDD_D2) U1.N33(VDD_D2) U1.N35(VDD_D2) U1.N37(VDD_D2) U1.N39(VDD_D2) U1.N41(VDD_D2) U1.N43(VDD_D2) U1.P1(VDD_D1) U1.P3(VDD_D1) U1.P5(VDD_D1) U1.P7(VDD_D1) U1.P9(VDD_D1) U1.P11(VDD_D1) U1.P13(VDD_D1) U1.P15(VDD_D1) U1.P17(VDD_D1) U1.P19(VDD_D1) U1.P21(VDD_D1) U1.P24(VDD_D2) U1.P26(VDD_D2) U1.P28(VDD_D2) U1.P30(VDD_D2) U1.P32(VDD_D2) U1.P34(VDD_D2) U1.P36(VDD_D2) U1.P38(VDD_D2) U1.P40(VDD_D2) U1.P42(VDD_D2) U1.P44(VDD_D2) U1.R2(VDD_D1) U1.R4(VDD_D1) U1.R6(VDD_D1) U1.R8(VDD_D1) U1.R10(VDD_D1) U1.R12(VDD_D1) U1.R14(VDD_D1) U1.R16(VDD_D1) U1.R18(VDD_D1) U1.R20(VDD_D1) U1.R22(VDD_D1) U1.R23(VDD_D2) U1.R25(VDD_D2) U1.R27(VDD_D2) U1.R29(VDD_D2) U1.R31(VDD_D2) U1.R33(VDD_D2) U1.R35(VDD_D2) U1.R37(VDD_D2) U1.R39(VDD_D2) U1.R41(VDD_D2) U1.R43(VDD_D2) U1.T1(VDD_D1) U1.T3(VDD_D1) U1.T5(VDD_D1) U1.T7(VDD_D1) U1.T9(VDD_D1) U1.T11(VDD_D1) U1.T13(VDD_D1) U1.T15(VDD_D1) U1.T17(VDD_D1) U1.T19(VDD_D1) U1.T21(VDD_D1) U1.T24(VDD_D2) U1.T26(VDD_D2) U1.T28(VDD_D2) U1.T30(VDD_D2) U1.T32(VDD_D2) U1.T34(VDD_D2) U1.T36(VDD_D2) U1.T38(VDD_D2) U1.T40(VDD_D2) U1.T42(VDD_D2) U1.T44(VDD_D2) U1.U2(VDD_D1) U1.U4(VDD_D1) U1.U6(VDD_D1) U1.U8(VDD_D1) U1.U10(VDD_D1) U1.U12(VDD_D1) U1.U14(VDD_D1) U1.U16(VDD_D1) U1.U18(VDD_D1) U1.U20(VDD_D1) U1.U22(VDD_D1) U1.U23(VDD_D2) U1.U25(VDD_D2) U1.U27(VDD_D2) U1.U29(VDD_D2) U1.U31(VDD_D2) U1.U33(VDD_D2) U1.U35(VDD_D2) U1.U37(VDD_D2) U1.U39(VDD_D2) U1.U41(VDD_D2) U1.U43(VDD_D2) U1.V1(VDD_D1) U1.V3(VDD_D1) U1.V5(VDD_D1) U1.V7(VDD_D1) U1.V9(VDD_D1) U1.V11(VDD_D1) U1.V13(VDD_D1) U1.V15(VDD_D1) U1.V17(VDD_D1) U1.V19(VDD_D1) U1.V21(VDD_D1) U1.V24(VDD_D2) U1.V26(VDD_D2) U1.V28(VDD_D2) U1.V30(VDD_D2) U1.V32(VDD_D2) U1.V34(VDD_D2) U1.V36(VDD_D2) U1.V38(VDD_D2) U1.V40(VDD_D2) U1.V42(VDD_D2) U1.V44(VDD_D2) U1.W2(VDD_D1) U1.W4(VDD_D1) U1.W6(VDD_D1) U1.W8(VDD_D1) U1.W10(VDD_D1) U1.W12(VDD_D1) U1.W14(VDD_D1) U1.W16(VDD_D1) U1.W18(VDD_D1) U1.W20(VDD_D1) U1.W22(VDD_D1) U1.W23(VDD_D2) U1.W25(VDD_D2) U1.W27(VDD_D2) U1.W29(VDD_D2) U1.W31(VDD_D2) U1.W33(VDD_D2) U1.W35(VDD_D2) U1.W37(VDD_D2) U1.W39(VDD_D2) U1.W41(VDD_D2) U1.W43(VDD_D2) U1.Y1(VDD_D1) U1.Y3(VDD_D1) U1.Y5(VDD_D1) U1.Y7(VDD_D1) U1.Y9(VDD_D1) U1.Y11(VDD_D1) U1.Y13(VDD_D1) U1.Y15(VDD_D1) U1.Y17(VDD_D1) U1.Y19(VDD_D1) U1.Y21(VDD_D1) U1.Y24(VDD_D2) U1.Y26(VDD_D2) U1.Y28(VDD_D2) U1.Y30(VDD_D2) U1.Y32(VDD_D2) U1.Y34(VDD_D2) U1.Y36(VDD_D2) U1.Y38(VDD_D2) U1.Y40(VDD_D2) U1.Y42(VDD_D2) U1.Y44(VDD_D2) ; port 1V
GND: C19.1 C36.1 C188.1 C189.1 C190.1 C191.1 C192.1 C193.1 C194.1 C195.1 C196.1 C197.1 C198.1 C199.1 C200.1 C201.1 C202.1 C203.1 C204.1 C205.1 C206.1 C207.1 C208.1 C209.1 C210.1 C211.1 C212.1 C213.1 C214.1 C215.1 C216.1 C217.1 C218.1 C219.1 C220.1 C221.1 C222.1 C223.1 C224.1 C225.1 C226.1 C227.1 C228.1 C229.1 C230.1 C231.1 C232.1 C233.1 C234.1 C235.1 C237.1 C238.1 C239.1 C240.1 C241.1 C242.1 C243.1 C244.1 C245.1 C246.1 C247.1 C248.1 C249.1 C250.1 C251.1 C252.1 C253.1 C254.1 C255.1 C256.1 C257.1 C258.1 C259.1 C260.1 C261.1 C262.1 C263.1 C264.1 C265.1 C266.1 U1.A3(VSS) U1.A5(VSS) U1.A7(VSS) U1.A38(VSS) U1.A40(VSS) U1.A42(VSS) U1.A44(VSS) U1.AA1(VSS) U1.AA3(VSS) U1.AA5(VSS) U1.AA7(VSS) U1.AA9(VSS) U1.AA11(VSS) U1.AA13(VSS) U1.AA15(VSS) U1.AA17(VSS) U1.AA19(VSS) U1.AA21(VSS) U1.AA24(VSS) U1.AA26(VSS) U1.AA28(VSS) U1.AA30(VSS) U1.AA32(VSS) U1.AA34(VSS) U1.AA36(VSS) U1.AA38(VSS) U1.AA40(VSS) U1.AA42(VSS) U1.AA44(VSS) U1.AB2(VSS) U1.AB4(VSS) U1.AB6(VSS) U1.AB8(VSS) U1.AB10(VSS) U1.AB12(VSS) U1.AB14(VSS) U1.AB16(VSS) U1.AB18(VSS) U1.AB20(VSS) U1.AB22(VSS) U1.AB23(VSS) U1.AB25(VSS) U1.AB27(VSS) U1.AB29(VSS) U1.AB31(VSS) U1.AB33(VSS) U1.AB35(VSS) U1.AB37(VSS) U1.AB39(VSS) U1.AB41(VSS) U1.AB43(VSS) U1.AC2(VSS) U1.AC4(VSS) U1.AC6(VSS) U1.AC8(VSS) U1.AC10(VSS) U1.AC12(VSS) U1.AC14(VSS) U1.AC16(VSS) U1.AC18(VSS) U1.AC20(VSS) U1.AC22(VSS) U1.AC23(VSS) U1.AC25(VSS) U1.AC27(VSS) U1.AC29(VSS) U1.AC31(VSS) U1.AC33(VSS) U1.AC35(VSS) U1.AC37(VSS) U1.AC39(VSS) U1.AC41(VSS) U1.AC43(VSS) U1.AD1(VSS) U1.AD3(VSS) U1.AD5(VSS) U1.AD7(VSS) U1.AD9(VSS) U1.AD11(VSS) U1.AD13(VSS) U1.AD15(VSS) U1.AD17(VSS) U1.AD19(VSS) U1.AD21(VSS) U1.AD24(VSS) U1.AD26(VSS) U1.AD28(VSS) U1.AD30(VSS) U1.AD32(VSS) U1.AD34(VSS) U1.AD36(VSS) U1.AD38(VSS) U1.AD40(VSS) U1.AD42(VSS) U1.AD44(VSS) U1.AE2(VSS) U1.AE4(VSS) U1.AE6(VSS) U1.AE8(VSS) U1.AE10(VSS) U1.AE12(VSS) U1.AE14(VSS) U1.AE16(VSS) U1.AE18(VSS) U1.AE20(VSS) U1.AE22(VSS) U1.AE23(VSS) U1.AE25(VSS) U1.AE27(VSS) U1.AE29(VSS) U1.AE31(VSS) U1.AE33(VSS) U1.AE35(VSS) U1.AE37(VSS) U1.AE39(VSS) U1.AE41(VSS) U1.AE43(VSS) U1.AF1(VSS) U1.AF3(VSS) U1.AF5(VSS) U1.AF7(VSS) U1.AF9(VSS) U1.AF11(VSS) U1.AF13(VSS) U1.AF15(VSS) U1.AF17(VSS) U1.AF19(VSS) U1.AF21(VSS) U1.AF26(VSS) U1.AF28(VSS) U1.AF30(VSS) U1.AF32(VSS) U1.AF34(VSS) U1.AF36(VSS) U1.AF38(VSS) U1.AF40(VSS) U1.AF42(VSS) U1.AF44(VSS) U1.AG2(VSS) U1.AG4(VSS) U1.AG6(VSS) U1.AG8(VSS) U1.AG10(VSS) U1.AG12(VSS) U1.AG14(VSS) U1.AG16(VSS) U1.AG18(VSS) U1.AG20(VSS) U1.AG22(VSS) U1.AG23(VSS) U1.AG25(VSS) U1.AG27(VSS) U1.AG29(VSS) U1.AG31(VSS) U1.AG33(VSS) U1.AG35(VSS) U1.AG41(VSS) U1.AG43(VSS) U1.AH1(VSS) U1.AH3(VSS) U1.AH5(VSS) U1.AH7(VSS) U1.AH9(VSS) U1.AH11(VSS) U1.AH13(VSS) U1.AH15(VSS) U1.AH17(VSS) U1.AH19(VSS) U1.AH21(VSS) U1.AH24(VSS) U1.AH26(VSS) U1.AH28(VSS) U1.AH30(VSS) U1.AH32(VSS) U1.AH34(VSS) U1.AH36(VSS) U1.AH38(VSS) U1.AH40(VSS) U1.AH42(VSS) U1.AJ2(VSS) U1.AJ4(VSS) U1.AJ6(VSS) U1.AJ8(VSS) U1.AJ10(VSS) U1.AJ12(VSS) U1.AJ14(VSS) U1.AJ16(VSS) U1.AJ18(VSS) U1.AJ20(VSS) U1.AJ22(VSS) U1.AJ23(VSS) U1.AJ25(VSS) U1.AJ27(VSS) U1.AJ29(VSS) U1.AJ31(VSS) U1.AJ33(VSS) U1.AJ35(VSS) U1.AJ37(VSS) U1.AJ39(VSS) U1.AJ41(VSS) U1.AJ43(VSS) U1.AK1(VSS) U1.AK3(VSS) U1.AK5(VSS) U1.AK7(VSS) U1.AK9(VSS) U1.AK11(VSS) U1.AK13(VSS) U1.AK15(VSS) U1.AK17(VSS) U1.AK19(VSS) U1.AK21(VSS) U1.AK24(VSS) U1.AK26(VSS) U1.AK28(VSS) U1.AK30(VSS) U1.AK32(VSS) U1.AK34(VSS) U1.AK36(VSS) U1.AK38(VSS) U1.AK40(VSS) U1.AK42(VSS) U1.AK44(VSS) U1.AL2(VSS) U1.AL4(VSS) U1.AL6(VSS) U1.AL8(VSS) U1.AL10(VSS) U1.AL12(VSS) U1.AL14(VSS) U1.AL16(VSS) U1.AL18(VSS) U1.AL20(VSS) U1.AL22(VSS) U1.AL23(VSS) U1.AL25(VSS) U1.AL27(VSS) U1.AL29(VSS) U1.AL31(VSS) U1.AL33(VSS) U1.AL35(VSS) U1.AL37(VSS) U1.AL39(VSS) U1.AL41(VSS) U1.AL43(VSS) U1.AM1(VSS) U1.AM3(VSS) U1.AM5(VSS) U1.AM7(VSS) U1.AM9(VSS) U1.AM11(VSS) U1.AM13(VSS) U1.AM15(VSS) U1.AM17(VSS) U1.AM19(VSS) U1.AM21(VSS) U1.AM24(VSS) U1.AM26(VSS) U1.AM28(VSS) U1.AM30(VSS) U1.AM32(VSS) U1.AM34(VSS) U1.AM36(VSS) U1.AM38(VSS) U1.AM40(VSS) U1.AM42(VSS) U1.AM44(VSS) U1.AN2(VSS) U1.AN4(VSS) U1.AN6(VSS) U1.AN8(VSS) U1.AN10(VSS) U1.AN12(VSS) U1.AN14(VSS) U1.AN16(VSS) U1.AN18(VSS) U1.AN20(VSS) U1.AN22(VSS) U1.AN23(VSS) U1.AN25(VSS) U1.AN27(VSS) U1.AN29(VSS) U1.AN31(VSS) U1.AN33(VSS) U1.AN35(VSS) U1.AN37(VSS) U1.AN39(VSS) U1.AN41(VSS) U1.AN43(VSS) U1.AP1(VSS) U1.AP3(VSS) U1.AP5(VSS) U1.AP7(VSS) U1.AP9(VSS) U1.AP11(VSS) U1.AP13(VSS) U1.AP15(VSS) U1.AP17(VSS) U1.AP19(VSS) U1.AP21(VSS) U1.AP24(VSS) U1.AP26(VSS) U1.AP28(VSS) U1.AP30(VSS) U1.AP32(VSS) U1.AP34(VSS) U1.AP36(VSS) U1.AP38(VSS) U1.AP40(VSS) U1.AP42(VSS) U1.AP44(VSS) U1.AR2(VSS) U1.AR4(VSS) U1.AR6(VSS) U1.AR8(VSS) U1.AR10(VSS) U1.AR12(VSS) U1.AR14(VSS) U1.AR16(VSS) U1.AR18(VSS) U1.AR20(VSS) U1.AR22(VSS) U1.AR23(VSS) U1.AR25(VSS) U1.AR27(VSS) U1.AR29(VSS) U1.AR31(VSS) U1.AR33(VSS) U1.AR35(VSS) U1.AR37(VSS) U1.AR39(VSS) U1.AR41(VSS) U1.AR43(VSS) U1.AT1(VSS) U1.AT3(VSS) U1.AT5(VSS) U1.AT7(VSS) U1.AT9(VSS) U1.AT11(VSS) U1.AT13(VSS) U1.AT15(VSS) U1.AT17(VSS) U1.AT19(VSS) U1.AT21(VSS) U1.AT24(VSS) U1.AT26(VSS) U1.AT28(VSS) U1.AT30(VSS) U1.AT32(VSS) U1.AT34(VSS) U1.AT36(VSS) U1.AT38(VSS) U1.AT40(VSS) U1.AT42(VSS) U1.AT44(VSS) U1.AU2(VSS) U1.AU4(VSS) U1.AU6(VSS) U1.AU8(VSS) U1.AU10(VSS) U1.AU12(VSS) U1.AU16(VSS) U1.AU18(VSS) U1.AU20(VSS) U1.AU22(VSS) U1.AU23(VSS) U1.AU25(VSS) U1.AU27(VSS) U1.AU29(VSS) U1.AU31(VSS) U1.AU33(VSS) U1.AU35(VSS) U1.AU37(VSS) U1.AU39(VSS) U1.AU41(VSS) U1.AU43(VSS) U1.AV1(VSS) U1.AV3(VSS) U1.AV5(VSS) U1.AV11(VSS) U1.AV13(VSS) U1.AV15(VSS) U1.AV17(VSS) U1.AV19(VSS) U1.AV21(VSS) U1.AV24(VSS) U1.AV26(VSS) U1.AV28(VSS) U1.AV30(VSS) U1.AV32(VSS) U1.AV34(VSS) U1.AV36(VSS) U1.AV38(VSS) U1.AV40(VSS) U1.AV42(VSS) U1.AV44(VSS) U1.AW2(VSS) U1.AW4(VSS) U1.AW6(VSS) U1.AW8(VSS) U1.AW10(VSS) U1.AW12(VSS) U1.AW14(VSS) U1.AW16(VSS) U1.AW18(VSS) U1.AW20(VSS) U1.AW22(VSS) U1.AW23(VSS) U1.AW25(VSS) U1.AW27(VSS) U1.AW29(VSS) U1.AW31(VSS) U1.AW33(VSS) U1.AW35(VSS) U1.AW37(VSS) U1.AW39(VSS) U1.AW41(VSS) U1.AW43(VSS) U1.AY1(VSS) U1.AY3(VSS) U1.AY5(VSS) U1.AY7(VSS) U1.AY9(VSS) U1.AY11(VSS) U1.AY13(VSS) U1.AY15(VSS) U1.AY19(VSS) U1.AY21(VSS) U1.AY24(VSS) U1.AY26(VSS) U1.AY28(VSS) U1.AY30(VSS) U1.AY32(VSS) U1.AY34(VSS) U1.AY36(VSS) U1.AY38(VSS) U1.AY40(VSS) U1.AY42(VSS) U1.AY44(VSS) U1.B2(VSS) U1.B4(VSS) U1.B6(VSS) U1.B8(VSS) U1.B22(VSS) U1.B23(VSS) U1.B37(VSS) U1.B39(VSS) U1.B41(VSS) U1.B43(VSS) U1.BA2(VSS) U1.BA4(VSS) U1.BA6(VSS) U1.BA8(VSS) U1.BA10(VSS) U1.BA12(VSS) U1.BA14(VSS) U1.BA16(VSS) U1.BA18(VSS) U1.BA20(VSS) U1.BA22(VSS) U1.BA23(VSS) U1.BA25(VSS) U1.BA27(VSS) U1.BA29(VSS) U1.BA31(VSS) U1.BA33(VSS) U1.BA35(VSS) U1.BA37(VSS) U1.BA39(VSS) U1.BA41(VSS) U1.BA43(VSS) U1.BB1(VSS) U1.BB3(VSS) U1.BB5(VSS) U1.BB7(VSS) U1.BB24(VSS) U1.BB38(VSS) U1.BB40(VSS) U1.BB42(VSS) U1.BB44(VSS) U1.BC2(VSS) U1.BC4(VSS) U1.BC6(VSS) U1.BC8(VSS) U1.BC22(VSS) U1.BC23(VSS) U1.BC37(VSS) U1.BC39(VSS) U1.BC41(VSS) U1.BC43(VSS) U1.BD1(VSS) U1.BD3(VSS) U1.BD5(VSS) U1.BD7(VSS) U1.BD38(VSS) U1.BD40(VSS) U1.BD42(VSS) U1.BD44(VSS) U1.C1(VSS) U1.C3(VSS) U1.C5(VSS) U1.C7(VSS) U1.C21(VSS) U1.C36(VSS) U1.C38(VSS) U1.C40(VSS) U1.C42(VSS) U1.C44(VSS) U1.D2(VSS) U1.D4(VSS) U1.D6(VSS) U1.D8(VSS) U1.D10(VSS) U1.D12(VSS) U1.D14(VSS) U1.D16(VSS) U1.D18(VSS) U1.D20(VSS) U1.D22(VSS) U1.D23(VSS) U1.D25(VSS) U1.D27(VSS) U1.D29(VSS) U1.D31(VSS) U1.D33(VSS) U1.D35(VSS) U1.D37(VSS) U1.D39(VSS) U1.D41(VSS) U1.D43(VSS) U1.E1(VSS) U1.E3(VSS) U1.E5(VSS) U1.E7(VSS) U1.E9(VSS) U1.E11(VSS) U1.E13(VSS) U1.E15(VSS) U1.E17(VSS) U1.E19(VSS) U1.E21(VSS) U1.E24(VSS) U1.E26(VSS) U1.E28(VSS) U1.E30(VSS) U1.E32(VSS) U1.E34(VSS) U1.E36(VSS) U1.E38(VSS) U1.E40(VSS) U1.E42(VSS) U1.E44(VSS) U1.F2(VSS) U1.F4(VSS) U1.F6(VSS) U1.F8(VSS) U1.F10(VSS) U1.F12(VSS) U1.F14(VSS) U1.F16(VSS) U1.F18(VSS) U1.F20(VSS) U1.F22(VSS) U1.F23(VSS) U1.F25(VSS) U1.F27(VSS) U1.F29(VSS) U1.F31(VSS) U1.F33(VSS) U1.F35(VSS) U1.F37(VSS) U1.F39(VSS) U1.F41(VSS) U1.F43(VSS) U1.G1(VSS) U1.G3(VSS) U1.G5(VSS) U1.G7(VSS) U1.G9(VSS) U1.G11(VSS) U1.G13(VSS) U1.G15(VSS) U1.G17(VSS) U1.G19(VSS) U1.G21(VSS) U1.G24(VSS) U1.G26(VSS) U1.G28(VSS) U1.G30(VSS) U1.G32(VSS) U1.G34(VSS) U1.G36(VSS) U1.G38(VSS) U1.G40(VSS) U1.G42(VSS) U1.G44(VSS) U1.H2(VSS) U1.H4(VSS) U1.H6(VSS) U1.H8(VSS) U1.H10(VSS) U1.H12(VSS) U1.H14(VSS) U1.H16(VSS) U1.H18(VSS) U1.H20(VSS) U1.H22(VSS) U1.H23(VSS) U1.H25(VSS) U1.H27(VSS) U1.H29(VSS) U1.H31(VSS) U1.H33(VSS) U1.H35(VSS) U1.H37(VSS) U1.H39(VSS) U1.H41(VSS) U1.H43(VSS) U1.J1(VSS) U1.J3(VSS) U1.J5(VSS) U1.J7(VSS) U1.J9(VSS) U1.J11(VSS) U1.J13(VSS) U1.J15(VSS) U1.J17(VSS) U1.J19(VSS) U1.J21(VSS) U1.J24(VSS) U1.J26(VSS) U1.J28(VSS) U1.J30(VSS) U1.J32(VSS) U1.J34(VSS) U1.J36(VSS) U1.J38(VSS) U1.J40(VSS) U1.J42(VSS) U1.J44(VSS) U1.K2(VSS) U1.K4(VSS) U1.K6(VSS) U1.K8(VSS) U1.K10(VSS) U1.K12(VSS) U1.K14(VSS) U1.K16(VSS) U1.K18(VSS) U1.K20(VSS) U1.K22(VSS) U1.K23(VSS) U1.K25(VSS) U1.K27(VSS) U1.K29(VSS) U1.K31(VSS) U1.K33(VSS) U1.K35(VSS) U1.K37(VSS) U1.K39(VSS) U1.K41(VSS) U1.K43(VSS) U1.L1(VSS) U1.L3(VSS) U1.L5(VSS) U1.L7(VSS) U1.L9(VSS) U1.L11(VSS) U1.L13(VSS) U1.L15(VSS) U1.L17(VSS) U1.L19(VSS) U1.L21(VSS) U1.L24(VSS) U1.L26(VSS) U1.L28(VSS) U1.L30(VSS) U1.L32(VSS) U1.L34(VSS) U1.L36(VSS) U1.L38(VSS) U1.L40(VSS) U1.L42(VSS) U1.L44(VSS) U1.M2(VSS) U1.M4(VSS) U1.M6(VSS) U1.M8(VSS) U1.M10(VSS) U1.M12(VSS) U1.M14(VSS) U1.M16(VSS) U1.M18(VSS) U1.M20(VSS) U1.M22(VSS) U1.M23(VSS) U1.M25(VSS) U1.M27(VSS) U1.M29(VSS) U1.M31(VSS) U1.M33(VSS) U1.M35(VSS) U1.M37(VSS) U1.M39(VSS) U1.M41(VSS) U1.M43(VSS) U1.N1(VSS) U1.N3(VSS) U1.N5(VSS) U1.N7(VSS) U1.N9(VSS) U1.N11(VSS) U1.N13(VSS) U1.N15(VSS) U1.N17(VSS) U1.N19(VSS) U1.N21(VSS) U1.N24(VSS) U1.N26(VSS) U1.N28(VSS) U1.N30(VSS) U1.N32(VSS) U1.N34(VSS) U1.N36(VSS) U1.N38(VSS) U1.N40(VSS) U1.N42(VSS) U1.N44(VSS) U1.P2(VSS) U1.P4(VSS) U1.P6(VSS) U1.P8(VSS) U1.P10(VSS) U1.P12(VSS) U1.P14(VSS) U1.P16(VSS) U1.P18(VSS) U1.P20(VSS) U1.P22(VSS) U1.P23(VSS) U1.P25(VSS) U1.P27(VSS) U1.P29(VSS) U1.P31(VSS) U1.P33(VSS) U1.P35(VSS) U1.P37(VSS) U1.P39(VSS) U1.P41(VSS) U1.P43(VSS) U1.R1(VSS) U1.R3(VSS) U1.R5(VSS) U1.R7(VSS) U1.R9(VSS) U1.R11(VSS) U1.R13(VSS) U1.R15(VSS) U1.R17(VSS) U1.R19(VSS) U1.R21(VSS) U1.R24(VSS) U1.R26(VSS) U1.R28(VSS) U1.R30(VSS) U1.R32(VSS) U1.R34(VSS) U1.R36(VSS) U1.R38(VSS) U1.R40(VSS) U1.R42(VSS) U1.R44(VSS) U1.T2(VSS) U1.T4(VSS) U1.T6(VSS) U1.T8(VSS) U1.T10(VSS) U1.T12(VSS) U1.T14(VSS) U1.T16(VSS) U1.T18(VSS) U1.T20(VSS) U1.T22(VSS) U1.T23(VSS) U1.T25(VSS) U1.T27(VSS) U1.T29(VSS) U1.T31(VSS) U1.T33(VSS) U1.T35(VSS) U1.T37(VSS) U1.T39(VSS) U1.T41(VSS) U1.T43(VSS) U1.U1(VSS) U1.U3(VSS) U1.U5(VSS) U1.U7(VSS) U1.U9(VSS) U1.U11(VSS) U1.U13(VSS) U1.U15(VSS) U1.U17(VSS) U1.U19(VSS) U1.U21(VSS) U1.U24(VSS) U1.U26(VSS) U1.U28(VSS) U1.U30(VSS) U1.U32(VSS) U1.U34(VSS) U1.U36(VSS) U1.U38(VSS) U1.U40(VSS) U1.U42(VSS) U1.U44(VSS) U1.V2(VSS) U1.V4(VSS) U1.V6(VSS) U1.V8(VSS) U1.V10(VSS) U1.V12(VSS) U1.V14(VSS) U1.V16(VSS) U1.V18(VSS) U1.V20(VSS) U1.V22(VSS) U1.V23(VSS) U1.V25(VSS) U1.V27(VSS) U1.V29(VSS) U1.V31(VSS) U1.V33(VSS) U1.V35(VSS) U1.V37(VSS) U1.V39(VSS) U1.V41(VSS) U1.V43(VSS) U1.W1(VSS) U1.W3(VSS) U1.W5(VSS) U1.W7(VSS) U1.W9(VSS) U1.W11(VSS) U1.W13(VSS) U1.W15(VSS) U1.W17(VSS) U1.W19(VSS) U1.W21(VSS) U1.W24(VSS) U1.W26(VSS) U1.W28(VSS) U1.W30(VSS) U1.W32(VSS) U1.W34(VSS) U1.W36(VSS) U1.W38(VSS) U1.W40(VSS) U1.W42(VSS) U1.W44(VSS) U1.Y2(VSS) U1.Y4(VSS) U1.Y6(VSS) U1.Y8(VSS) U1.Y10(VSS) U1.Y12(VSS) U1.Y14(VSS) U1.Y16(VSS) U1.Y18(VSS) U1.Y20(VSS) U1.Y22(VSS) U1.Y23(VSS) U1.Y25(VSS) U1.Y27(VSS) U1.Y29(VSS) U1.Y31(VSS) U1.Y33(VSS) U1.Y35(VSS) U1.Y37(VSS) U1.Y39(VSS) U1.Y41(VSS) U1.Y43(VSS) ; port GND
NetU1_AF24: U1.AF24(VSS) U1.AY17(VSS)
NetU1_AG37: U1.AG37(VSS) U1.AV7(VSS)
NetU1_AG39: U1.AG39(VSS) U1.AV9(VSS)
NetU1_AH44: U1.AH44(VSS) U1.AU14(VSS)
NetU1_AY27: U1.AY27(VDD_D3) U1.E27(VDD_D2)

## Notes on the sheet
- Block Name
- Document Type: Schematic
- Size
- File Name
- Variant
- Rev.
- Project Name
- Sheet
- /

## Library data of the parts
C19 C188-C226 = CAP000028169: DB_PART_TYPE: Ceramic_SMD\Standard_X7R; DB_MANUFACTURER_PART: KEMET    C0603C474J4RAC; NOTE: <NOTE>; DB_T_RANGE: -55 to 125; DB_PACKAGE: 0603; DB_DESCRIPTION: C X7R 470nF 5% 16V 0603; DB_STATUS: NEW; DB_PART_NUMBER: CAP000028169; DB_PCB_DEVICE: SMD_0603_CAPC1608X95N; DB_APPROVED_ON: 09.10.2010; DB_DATASHEET: http://john.epiqdesign.com/projects/CIS_Datasheets/F3102_CE_Kemet.pdf?rev=92&sc=0
C36 C227-C235 C237-C266 = CAP000047355: DB_PART_TYPE: Ceramic_SMD\Standard_X5R; DB_MANUFACTURER_PART: SAMSUNG    CL32A227MQVNNNE; NOTE: <NOTE>; DB_T_RANGE: -55 to 85; DB_PACKAGE: 1210; DB_DESCRIPTION: C X5R 220uF 20% 6.3V 1210; DB_APPROVED_BY: VSN; DB_STATUS: NEW; DB_PART_NUMBER: CAP000047355; DB_PCB_DEVICE: SMD_1210_CAPC3225X279N; DB_APPROVED_ON: 07.05.2014 11:28:08; DB_DATASHEET: http://john.epiqdesign.com/projects/CIS_Datasheets/CAP_CL32A227MQVNNNE.pdf?rev=1401&sc=0